# EAGLE design pcb-breakout-mdbt40 (EAGLE 7.4.0)
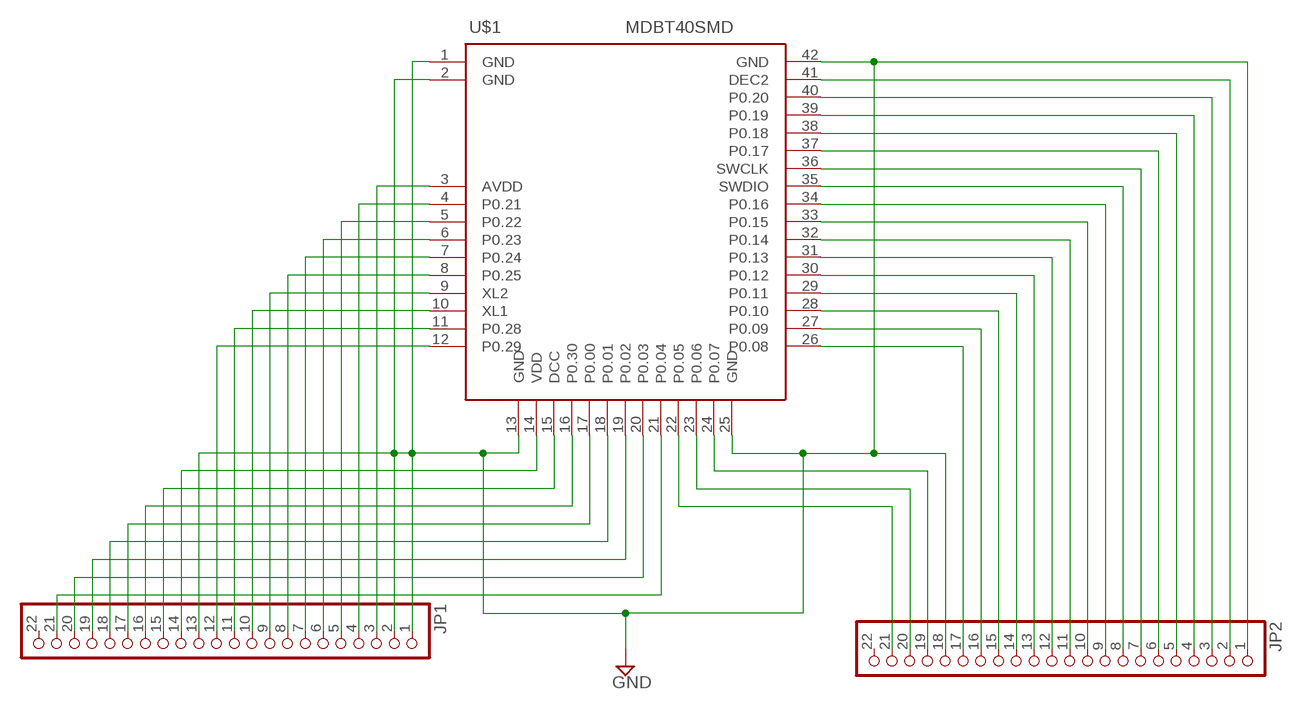
[diagram p0: schematic, sheet 1]

## Parts
JP1  PINHD-1X22  [1X22]
JP2  PINHD-1X22  [1X22]
U$1  MDBT40SMD  [MDBT40]

## Nets
GND: JP1.1 JP1.2 JP1.13 JP2.1 JP2.18 U$1.1(GND) U$1.2(GND) U$1.13(GND) U$1.25(GND) U$1.42(GND)
N$3: JP1.3 U$1.3(AVDD)
N$4: JP1.4 U$1.4(P0.21)
N$5: JP1.5 U$1.5(P0.22)
N$6: JP1.6 U$1.6(P0.23)
N$7: JP1.7 U$1.7(P0.24)
N$8: JP1.8 U$1.8(P0.25)
N$9: JP1.9 U$1.9(XL2)
N$10: JP1.10 U$1.10(XL1)
N$11: JP1.11 U$1.11(P0.28)
N$12: JP1.12 U$1.12(P0.29)
N$14: JP1.14 U$1.14(VDD)
N$15: JP1.15 U$1.15(DCC)
N$16: JP1.16 U$1.16(P0.30)
N$17: JP1.17 U$1.17(P0.00)
N$18: JP1.18 U$1.18(P0.01)
N$19: JP1.19 U$1.19(P0.02)
N$20: JP1.20 U$1.20(P0.03)
N$21: JP1.21 U$1.21(P0.04)
N$23: JP2.2 U$1.41(DEC2)
N$24: JP2.3 U$1.40(P0.20)
N$25: JP2.4 U$1.39(P0.19)
N$26: JP2.5 U$1.38(P0.18)
N$27: JP2.6 U$1.37(P0.17)
N$28: JP2.7 U$1.36(SWCLK)
N$29: JP2.8 U$1.35(SWDIO)
N$30: JP2.9 U$1.34(P0.16)
N$31: JP2.10 U$1.33(P0.15)
N$32: JP2.11 U$1.32(P0.14)
N$33: JP2.12 U$1.31(P0.13)
N$34: JP2.13 U$1.30(P0.12)
N$35: JP2.14 U$1.29(P0.11)
N$36: JP2.15 U$1.28(P0.10)
N$37: JP2.16 U$1.27(P0.09)
N$38: JP2.17 U$1.26(P0.08)
N$40: JP2.19 U$1.24(P0.07)
N$41: JP2.20 U$1.23(P0.06)
N$42: JP2.21 U$1.22(P0.05)
Unconnected: JP1.22 JP2.22

## Library data of the parts
JP1 JP2 = pinhead:PINHD-1X22: PIN HEADER
U$1 = MDBT40-v2-bluzDK:MDBT40

## Board
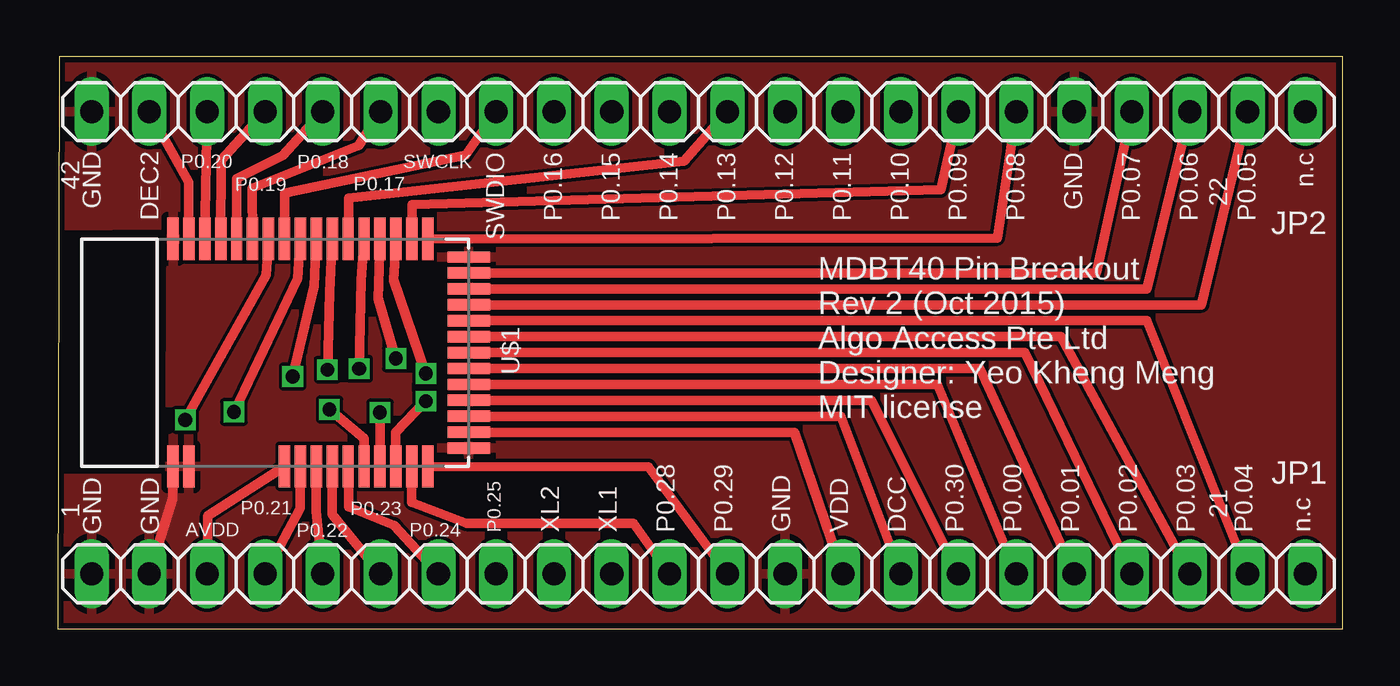
[diagram p1: board, top side]
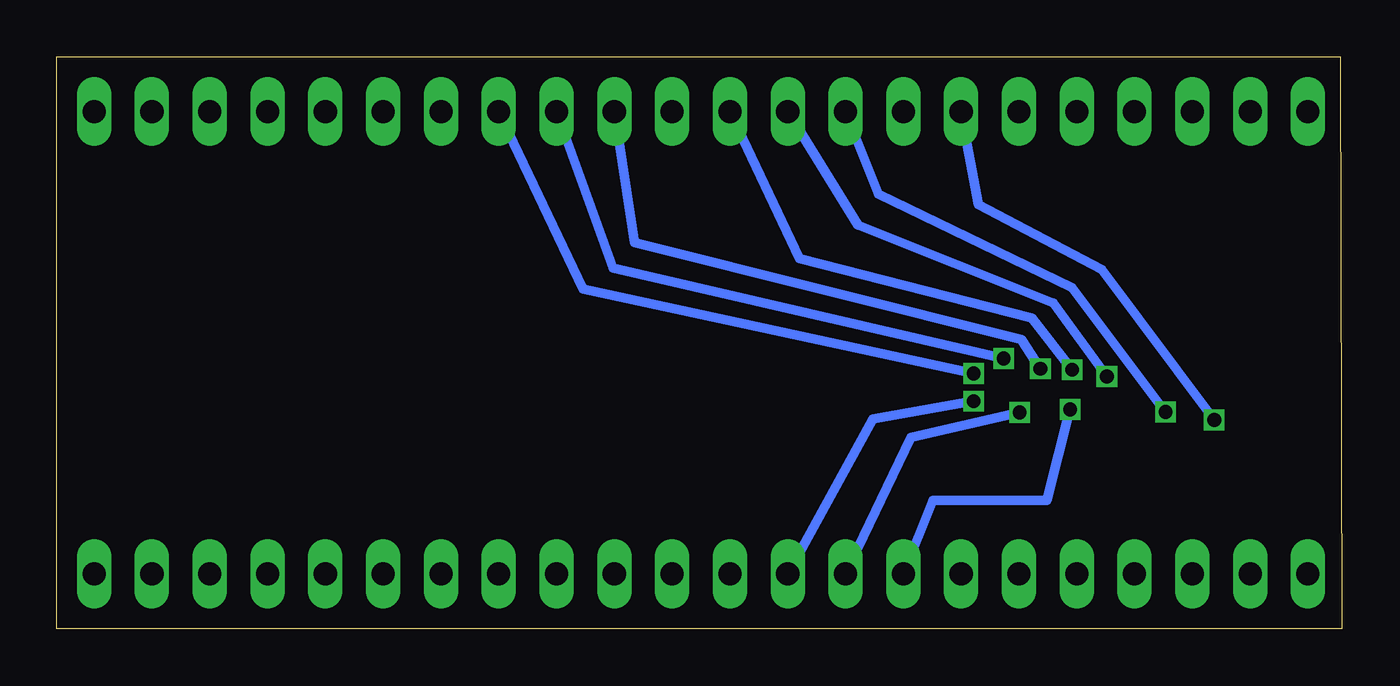
[diagram p2: board, bottom side, seen from below]

Size 56.47 x 25.15 mm. Coordinates in mm from the lower left corner, seen from the top.
Outline: 0,0 56.47,0 56.47,25.15 0.07,25.15 0,0
Copper layers (1*16): Top 0.035mm / dielectric 1.5mm / Bottom 0.035mm
Design rules "Elecrow_2-layer_eagle_rule": minimum track width 6mil, minimum drill 12mil, track to track 6mil, track to pad 6mil, pad to pad 6mil, via to via 6mil, smd to smd 0mil, copper to edge 10mil, drill to drill 10mil, minimum pad ring 10mil, minimum via ring 6mil, stop-mask expansion 2mil, vias tented up to drill 100mil, thermal gap 10mil

### Footprints (pad centres in the part's own frame; a part is rotated, then mirrored left to right if it is on the bottom)
1X22 = drill 1.016 long: 1 -26.67,0; 2 -24.13,0; 3 -21.59,0; 4 -19.05,0; 5 -16.51,0; 6 -13.97,0; 7 -11.43,0; 8 -8.89,0; 9 -6.35,0; 10 -3.81,0; 11 -1.27,0; 12 1.27,0; 13 3.81,0; 14 6.35,0; 15 8.89,0; 16 11.43,0; 17 13.97,0; 18 16.51,0; 19 19.05,0; 20 21.59,0; 21 24.13,0; 22 26.67,0
MDBT40 = smd 1.85 x 0.5: 1 -5,4; 2 -5,3.3; 3 -5,-0.9; 4 -5,-1.6; 5 -5,-2.3; 6 -5,-3; 7 -5,-3.7; 8 -5,-4.4; 9 -5,-5.1; 10 -5,-5.8; 11 -5,-6.5; 12 -5,-7.2; 26 5,-7.2; 27 5,-6.5; 28 5,-5.8; 29 5,-5.1; 30 5,-4.4; 31 5,-3.7; 32 5,-3; 33 5,-2.3; 34 5,-1.6; 35 5,-0.9; 36 5,-0.2; 37 5,0.5; 38 5,1.2; 39 5,1.9; 40 5,2.6; 41 5,3.3; 42 5,4 | smd 0.5 x 1.85: 13 -4.2,-9; 14 -3.5,-9; 15 -2.8,-9; 16 -2.1,-9; 17 -1.4,-9; 18 -0.7,-9; 19 0,-9; 20 0.7,-9; 21 1.4,-9; 22 2.1,-9; 23 2.8,-9; 24 3.5,-9; 25 4.2,-9

### Placement (x,y rotation side)
JP1  28.16,2.43 0 top
JP2  28.16,22.75 0 top
U$1  9.07,12.15 90 top

### Tracks (layer width: path | path; a pad name or v marks a point on that pad's centre or on a via)
GND
  Top 0.406: JP1.2 5.05,5.73 U$1.1
  pour Top: -0.03,24.97 55.97,24.97 55.97,0.15 -0.03,0.15 0.18,6.61 4.92,6.63 5,17.76 -0.16,17.72
N$3
  Top 0.406: JP1.3 6.6,4.98 U$1.3
N$4
  Top 0.406: U$1.4 10.66,5.31 JP1.4
N$5
  Top 0.406: U$1.5 11.37,5.17 JP1.5
N$6
  Top 0.406: U$1.6 12.07,5.03 JP1.6
N$7
  Top 0.406: U$1.7 12.78,5.37 14.79,4.56 JP1.7
N$8  (via drill 0.6)
  Top 0.406: v11.95,9.65 13.48,8.38 U$1.8
  Bottom 0.406: v11.95,9.65 12.97,5.65 17.97,5.65 JP1.8
N$9  (via drill 0.6)
  Top 0.406: U$1.9 v14.17,9.52
  Bottom 0.406: v14.17,9.52 18.93,8.43 JP1.9
N$10  (via drill 0.6)
  Top 0.406: v16.18,10.02 14.85,8.63 U$1.10
  Bottom 0.406: v16.18,10.02 20.61,9.23 JP1.10
N$11
  Top 0.406: U$1.11 15.56,5.57 17.97,4.65 25.32,4.65 JP1.11
N$12
  Top 0.406: JP1.12 25.97,7.13 U$1.12
N$14
  Top 0.406: U$1.14 32.39,8.65 JP1.14
N$15
  Top 0.406: U$1.15 34.42,9.35 JP1.15
N$16
  Top 0.406: U$1.16 35.76,10.05 JP1.16
N$17
  Top 0.406: U$1.17 38.66,10.75 JP1.17
N$18
  Top 0.406: U$1.18 40.54,11.45 JP1.18
N$19
  Top 0.406: U$1.19 42.5,12.15 JP1.19
N$20
  Top 0.406: U$1.20 44.1,12.85 JP1.20
N$21
  Top 0.406: U$1.21 47.86,13.55 JP1.21
N$23
  Top 0.406: U$1.41 5.76,19.65 JP2.2
N$24
  Top 0.406: U$1.40 JP2.3
N$25
  Top 0.406: U$1.39 7.19,20.6 JP2.4
N$26
  Top 0.406: U$1.38 7.87,19.8 9.9,20.8 JP2.5
N$27
  Top 0.406: U$1.37 8.56,19.37 13.24,21.24 JP2.6
N$28  (via drill 0.6)
  Top 0.406: U$1.36 9.16,15.55 v5.61,9.19
  Bottom 0.406: JP2.7 15.97,18.65 10.54,15.8 v5.61,9.19
N$29
  Top 0.406: JP2.8 17.92,20.83 9.97,19.15 U$1.35
N$30  (via drill 0.6)
  Top 0.406: U$1.34 10.56,15.41 v7.75,9.54
  Bottom 0.406: JP2.9 20.36,19.12 11.86,15.01 v7.75,9.54
N$31  (via drill 0.6)
  Top 0.406: U$1.33 11.27,15.07 v10.33,11.1
  Bottom 0.406: JP2.10 21.26,17.76 12.69,14.32 v10.33,11.1
N$32  (via drill 0.6)
  Top 0.406: U$1.32 11.96,14.81 v11.86,11.4
  Bottom 0.406: JP2.11 23.84,16.28 13.63,13.66 v11.86,11.4
N$33
  Top 0.406: U$1.31 12.78,18.94 27.53,20.56 JP2.12
N$34  (via drill 0.6)
  Top 0.406: U$1.30 13.35,15.35 v13.25,11.44
  Bottom 0.406: JP2.13 31.08,16.99 14.09,12.72 v13.25,11.44
N$35  (via drill 0.6)
  Top 0.406: U$1.29 14.09,14.53 v14.86,11.89
  Bottom 0.406: JP2.14 32.03,15.86 v14.86,11.89
N$36  (via drill 0.6)
  Top 0.406: U$1.28 14.77,15.35 v16.18,11.23
  Bottom 0.406: v16.18,11.23 33.34,14.94 JP2.15
N$37
  Top 0.406: JP2.16 38.81,19.31 15.57,18.65 U$1.27
N$38
  Top 0.406: U$1.26 41.29,17.19 JP2.17
N$40
  Top 0.406: U$1.24 45.64,15.65 JP2.19
N$41
  Top 0.406: U$1.23 47.86,14.95 JP2.20
N$42
  Top 0.406: U$1.22 50.27,14.25 JP2.21

### Text on the board
tPlace: GND | DEC2 | P0.20 | P0.18 | SWCLK | SWDIO | P0.16 | P0.15 | P0.14 | P0.13 | P0.12 | P0.11 | P0.10 | P0.09 | P0.08 | GND | P0.07 | P0.06 | P0.05 | n.c | 42 | P0.19 | P0.17 | 22 | MDBT40 Pin Breakout / Rev 2 (Oct 2015) / Algo Access Pte Ltd / Designer: Yeo Kheng Meng / MIT license | 1 | P0.21 | P0.23 | P0.25 | XL2 | XL1 | P0.28 | P0.29 | GND | VDD | DCC | P0.30 | P0.00 | P0.01 | P0.02 | P0.03 | 21 | P0.04 | n.c | GND | GND | AVDD | P0.22 | P0.24